# EAGLE design sensors_l (EAGLE 9.5.1)
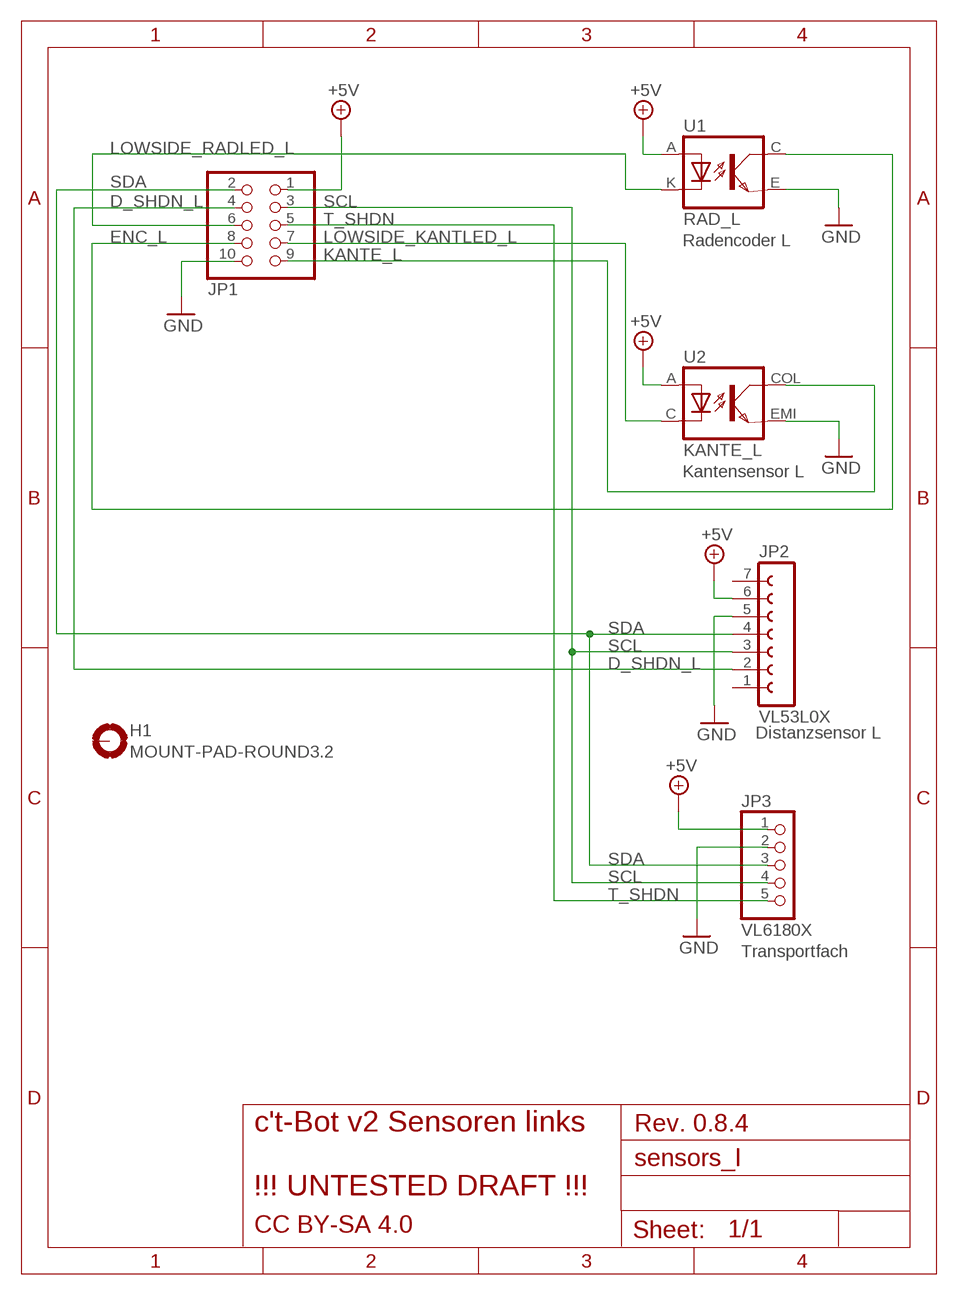
[diagram p0: schematic, sheet 1]

## Parts
H1  MOUNT-PAD-ROUND3.2  [3,2-PAD]
JP1  PINHD-2X5  [2X05]
JP2  VL53L0X  FE07W  [FE07W]
JP3  VL6180X  PINHD-1X5  [1X05]
U1  RAD_L  CNY70DEF  [4]
U2  KANTE_L  CNY70  [EDGE]

## Nets
+5V: JP1.1 JP2.6 JP3.1 U1.A U2.A
D_SHDN_L: JP1.4 JP2.2
ENC_L: JP1.8 U1.C(COL)
GND: JP1.10 JP2.5 JP3.2 U1.E(EMI) U2.EMI
KANTE_L: JP1.9 U2.COL
LOWSIDE_KANTLED_L: JP1.7 U2.C
LOWSIDE_RADLED_L: JP1.6 U1.K(C)
SCL: JP1.3 JP2.3 JP3.4
SDA: JP1.2 JP2.4 JP3.3
T_SHDN: JP1.5 JP3.5
Unconnected: H1.B3,2(MOUNT) JP2.1 JP2.7

## Notes on the sheet
- Radencoder L
- Kantensensor L
- Distanzsensor L
- Transportfach
- Rev. 0.8.4
- c't-Bot v2 Sensoren links
  
  !!! UNTESTED DRAFT !!!
- CC BY-SA 4.0

## Library data of the parts
H1 = holes:MOUNT-PAD-ROUND: MOUNTING PAD, round
JP1 = pinhead:PINHD-2X5: PIN HEADER
JP2 = ct-bot:FE07W: FEMALE HEADER; OC_FARNELL: unknown; OC_NEWARK: unknown
JP3 = ct-bot:PINHD-1X5: PIN HEADER
U1 U2 = ct-bot:CNY70

## Board
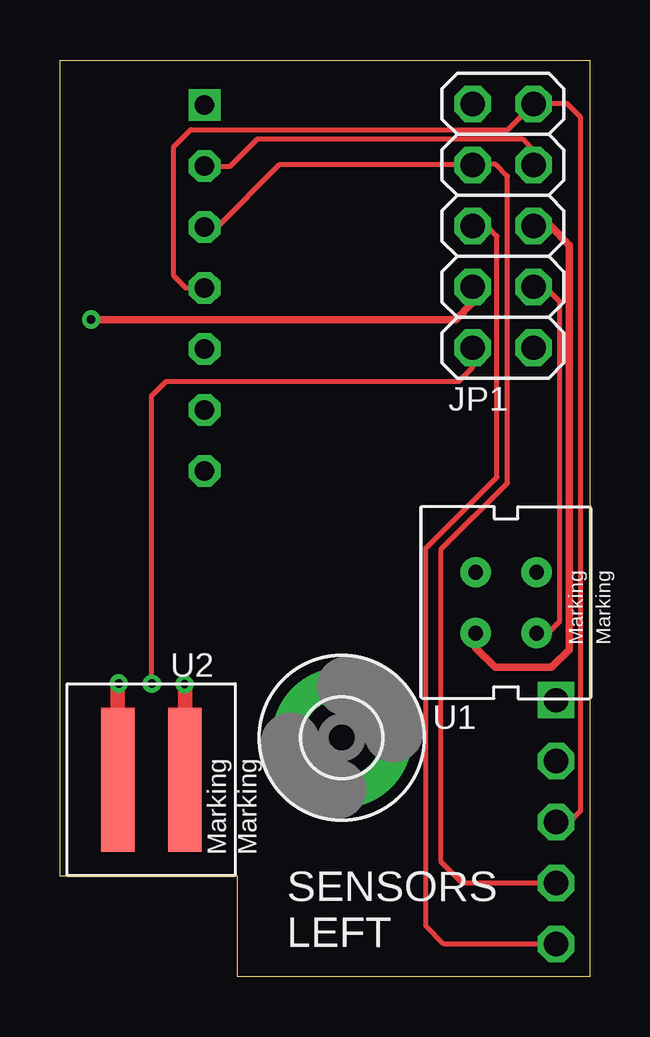
[diagram p1: board, top side]
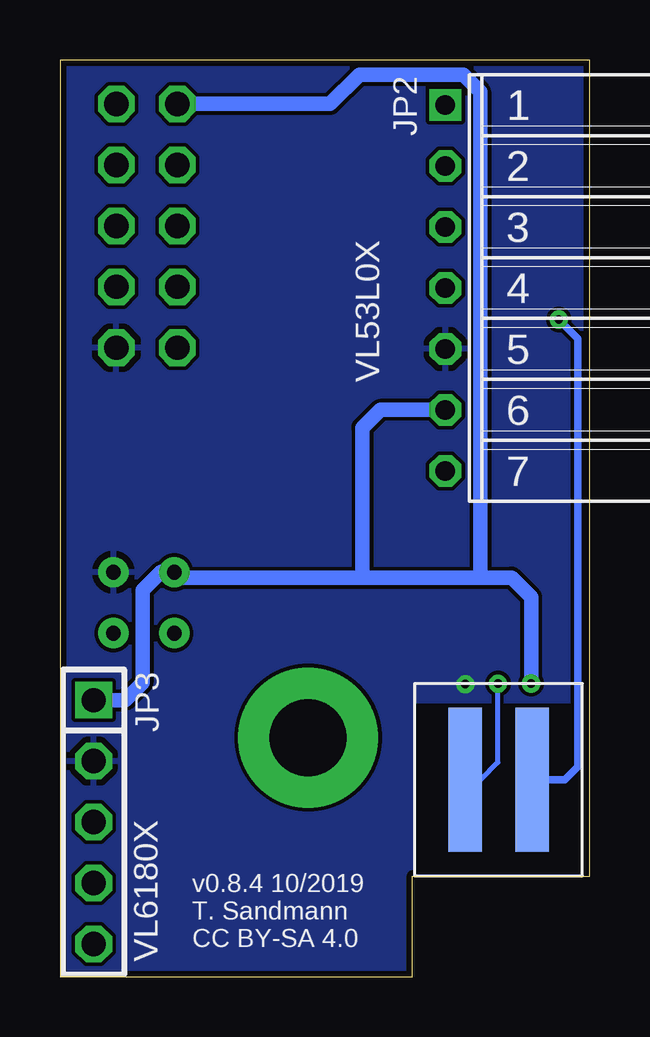
[diagram p2: board, bottom side, seen from below]

Size 22.1 x 38.2 mm. Coordinates in mm from the lower left corner, seen from the top.
Outline: 22.1,0 7.4,0 7.4,4.2 0,4.2 0,38.2 22.1,38.2 22.1,0
Copper layers (1*16): Top 0.035mm / dielectric 1.5mm / Bottom 0.035mm
Design rules "jlcpcb_2layer_DRU": minimum track width 6mil, minimum drill 0.3mm, track to track 6mil, track to pad 6mil, pad to pad 6mil, via to via 6mil, smd to smd 6mil, copper to edge 10mil, drill to drill 6mil, minimum pad ring 10mil, minimum via ring 8mil, stop-mask expansion 4mil, vias tented up to drill 0mil, thermal gap 10mil

### Footprints (pad centres in the part's own frame; a part is rotated, then mirrored left to right if it is on the bottom)
3,2-PAD = drill 3.2 pad 5.842: B3,2 0,0
2X05 = drill 1.016 octagon: 1 -5.08,-1.27; 2 -5.08,1.27; 3 -2.54,-1.27; 4 -2.54,1.27; 5 0,-1.27; 6 0,1.27; 7 2.54,-1.27; 8 2.54,1.27; 9 5.08,-1.27; 10 5.08,1.27
FE07W = drill 0.813 square: 1 -7.62,0 | drill 0.813 octagon: 2 -5.08,0; 3 -2.54,0; 4 0,0; 5 2.54,0; 6 5.08,0; 7 7.62,0
1X05 = drill 1.016 square: 1 -5.08,0 | drill 1.016 octagon: 2 -2.54,0; 3 0,0; 4 2.54,0; 5 5.08,0
4 = drill 0.61 pad 1.27: A -1.27,1.27; C 1.27,-1.27; E 1.27,1.27; K -1.27,-1.27
EDGE = smd 1.4 x 6: A 0,0; EMI 2.8,0 | smd 1.4 x 6 bottom: C 0,0; COL 2.8,0

### Placement (x,y rotation side)
H1  11.75,9.97 0 top
JP1  18.48,31.29 270 top
JP2  6.03,28.7 270 bottom
JP3  20.69,6.44 270 bottom
U1  18.6,15.59 0 top
U2  2.41,8.21 0 top

### Tracks (layer width: path | path; a pad name or v marks a point on that pad's centre or on a via)
+5V  (via drill 0.35)
  Top 0.61: U2.A 2.41,12.18 v2.45,12.22
  Bottom 0.61: JP3.1 19.38,11.53 18.66,12.25 18.66,16.1 17.89,16.88 17.35,16.88 U1.A 17.1,16.63 9.49,16.63 | 9.49,16.63 4.57,16.63 | 4.57,16.63 3.26,16.63 2.45,15.82 v2.45,12.22 | JP2.6 8.74,23.62 9.49,22.88 9.49,16.63 | JP1.1 10.83,36.37 9.62,37.59 5.28,37.59 4.57,36.88 4.57,16.63
D_SHDN_L
  Top 0.203: JP2.2 7.1,33.78 8.23,34.92 19.28,34.92 19.75,34.45 JP1.4
ENC_L
  Top 0.203: U1.C 20.34,14.32 20.84,14.82 20.84,28.13 20.2,28.77 19.77,28.77 JP1.8
GND  (via drill 0.35)
  Top 0.61: U2.EMI v5.21,12.18 v5.2,12.2
  pour Bottom (rank 6): 23.42,38.53 -0.75,38.53 -0.75,-0.29 23.42,-0.29
KANTE_L  (via drill 0.35)
  Top 0.203: v3.83,12.21 3.83,24.21 4.43,24.81 14.92,24.81 15.45,24.81 16.64,24.81 17.21,25.38 JP1.9
  Bottom 0.203: U2.COL 4.55,8.21 3.83,8.93 v3.83,12.21
LOWSIDE_KANTLED_L  (via drill 0.35)
  Top 0.305: JP1.7 17.21,28.09 16.5,27.39 v1.3,27.39
  Bottom 0.305: U2.C 1.04,8.21 0.5,8.75 0.5,26.59 v1.3,27.39
LOWSIDE_RADLED_L
  Top 0.305: U1.K 17.33,13.72 18.16,12.89 20.5,12.89 21.25,13.64 21.25,30.48 20.44,31.29 JP1.6
N$1
  cutout Bottom: 7.25,11.31 0.3,11.31 0.3,4.22 7.25,4.22
SCL
  Top 0.203: JP2.3 6.55,31.24 9.16,33.85 17.22,33.85 | JP3.4 16.79,3.91 15.89,4.8 15.89,17.81 18.66,20.57 18.66,33.36 18.17,33.85 17.34,33.85 17.22,33.85 | 17.22,33.85 JP1.3
SDA
  Top 0.203: JP3.3 20.71,6.43 21.23,6.43 21.72,6.91 21.72,35.81 21.15,36.38 JP1.2 18.67,35.3 5.45,35.3 4.74,34.59 4.74,29.22 5.26,28.7 JP2.4
T_SHDN
  Top 0.203: JP3.5 16.02,1.37 15.25,2.13 15.25,17.85 18.22,20.82 18.22,30.86 17.79,31.29 JP1.5

### Text on the board
tNames: SENSORS / LEFT
bNames: VL53L0X | v0.8.4 10/2019 / T. Sandmann / CC BY-SA 4.0 | VL6180X